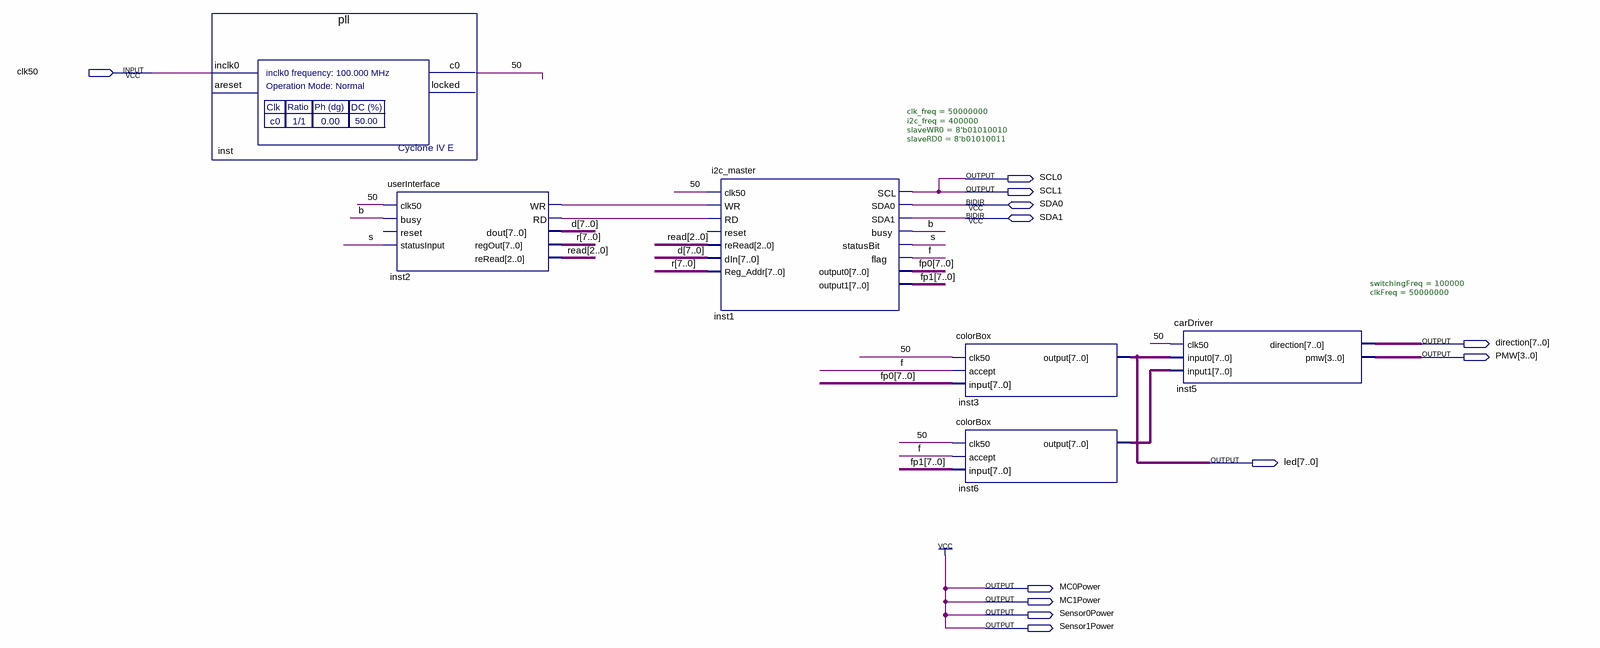
[diagram p0: schematic sheet]
// Quartus schematic schematic.bdf as structural Verilog: 6 symbols, 12 pins
module schematic (
  input  clk50,
  inout  SDA0,
  inout  SDA1,
  output SCL0,
  output SCL1,
  output [7:0] direction,
  output [3:0] PMW,
  output [7:0] led,
  output MC0Power,
  output MC1Power,
  output Sensor0Power,
  output Sensor1Power
);

  wire \50 , b, f, inst2_rd, inst2_wr, s;
  wire [2:0] read;
  wire [7:0] d, fp0, fp1, inst6_output, r;

  pll inst (.inclk0(clk50), .c0(\50 ));  // open: areset, locked
  userInterface inst2 (
    .clk50(\50 ), .busy(b), .statusInput(s), .WR(inst2_wr), .RD(inst2_rd), .dout(d), .regOut(r), .reRead(read));  // open: reset
  i2c_master #(.clk_freq(50000000), .i2c_freq(400000), .slaveWR0(8'b01010010), .slaveRD0(8'b01010011)) inst1 (
    .clk50(\50 ), .WR(inst2_wr), .RD(inst2_rd), .reRead(read), .dIn(d), .Reg_Addr(r), .SCL(SCL0), .busy(b),
    .statusBit(s), .flag(f), .output0(fp0), .output1(fp1), .SDA0(SDA0), .SDA1(SDA1));  // open: reset
  colorBox inst3 (.clk50(\50 ), .accept(f), .\input (fp0), .\output (led));
  colorBox inst6 (.clk50(\50 ), .accept(f), .\input (fp1), .\output (inst6_output));
  carDriver #(.switchingFreq(100000), .clkFreq(50000000)) inst5 (
    .clk50(\50 ), .input0(led), .input1(inst6_output), .direction(direction), .pmw(PMW));

  assign MC0Power = 1'b1;
  assign MC1Power = 1'b1;
  assign SCL1 = SCL0;
  assign Sensor0Power = 1'b1;
  assign Sensor1Power = 1'b1;
endmodule
